# EAGLE design CR78-SD (EAGLE 7.6.0)
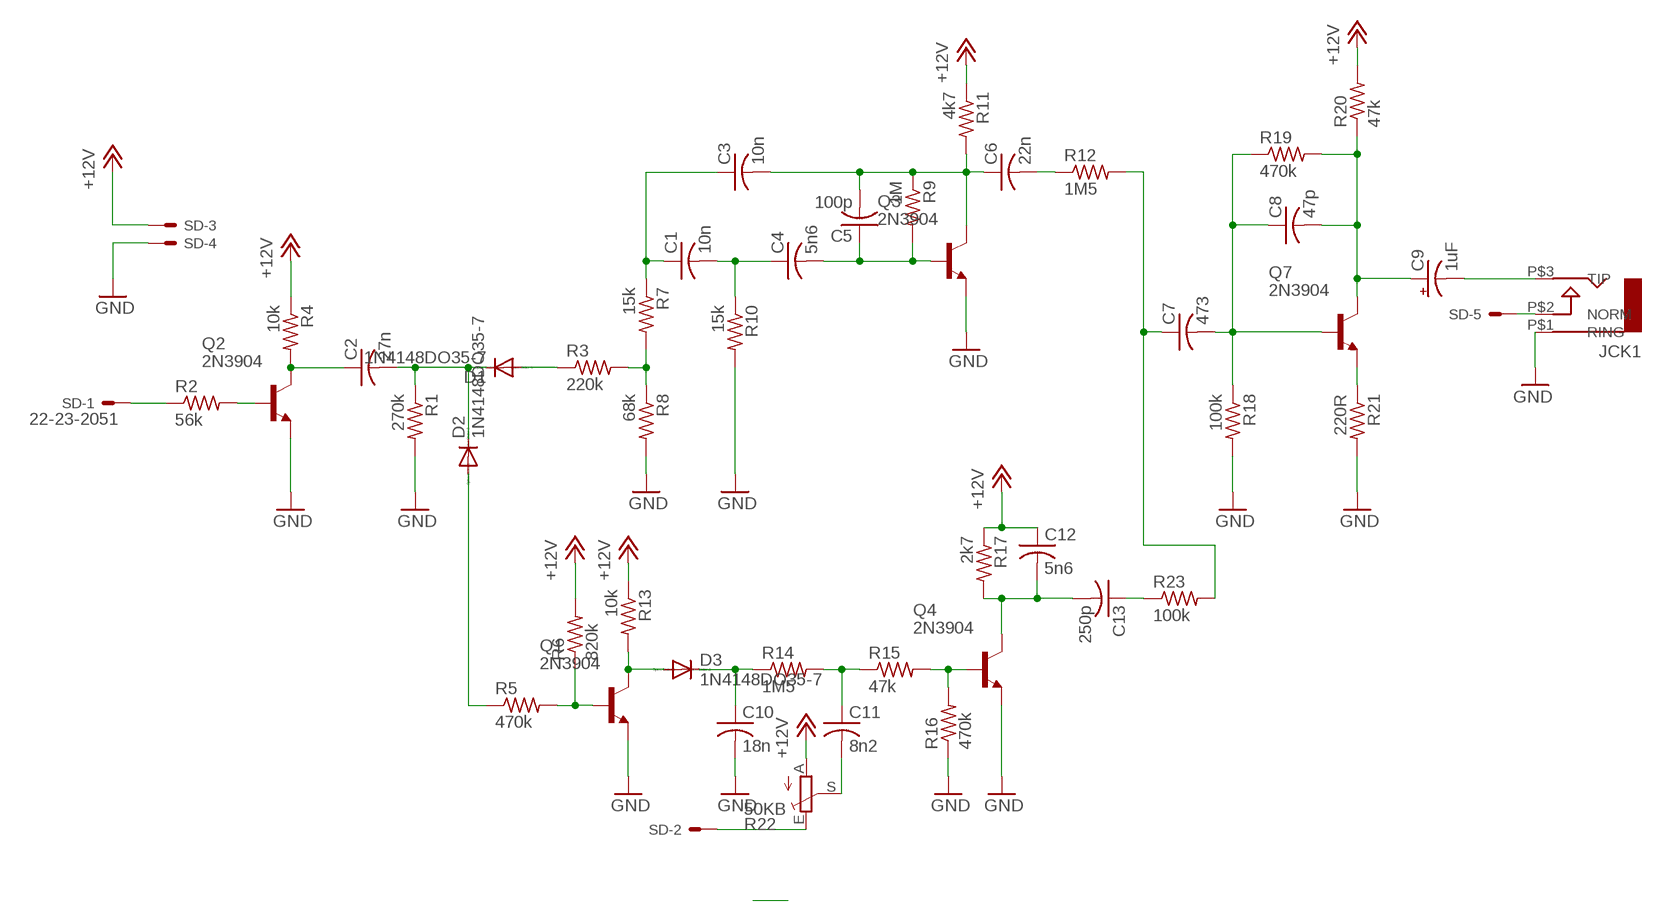
[diagram p0: schematic, sheet 1]

## Parts
C1  10n  C-US050-025X075  [C050-025X075]
C2  27n  C-US050-025X075  [C050-025X075]
C3  10n  C-US050-025X075  [C050-025X075]
C4  5n6  C-US050-025X075  [C050-025X075]
C5  100p  C-US050-025X075  [C050-025X075]
C6  22n  C-US050-025X075  [C050-025X075]
C7  473  C-US050-025X075  [C050-025X075]
C8  47p  C-US050-025X075  [C050-025X075]
C9  1uF  CPOL-USB45181B  [B45181B]
C10  18n  C-US050-025X075  [C050-025X075]
C11  8n2  C-US050-025X075  [C050-025X075]
C12  5n6  C-US050-025X075  [C050-025X075]
C13  250p  C-US050-025X075  [C050-025X075]
D1  1N4148DO35-7  [DO35-7]
D2  1N4148DO35-7  [DO35-7]
D3  1N4148DO35-7  [DO35-7]
JCK1  AUDIO-JACK  [ERTHENVAR-JACK-90DEG]
Q1  2N3904  [TO92]
Q2  2N3904  [TO92]
Q3  2N3904  [TO92]
Q4  2N3904  [TO92]
Q7  2N3904  [TO92]
R1  270k  R-US_0207/7  [0207/7]
R2  56k  R-US_0207/7  [0207/7]
R3  220k  R-US_0207/7  [0207/7]
R4  10k  R-US_0207/7  [0207/7]
R5  470k  R-US_0207/7  [0207/7]
R6  820k  R-US_0207/7  [0207/7]
R7  15k  R-US_0207/7  [0207/7]
R8  68k  R-US_0207/7  [0207/7]
R9  1M  R-US_0207/7  [0207/7]
R10  15k  R-US_0207/7  [0207/7]
R11  4k7  R-US_0207/7  [0207/7]
R12  1M5  R-US_0207/7  [0207/7]
R13  10k  R-US_0207/7  [0207/7]
R14  1M5  R-US_0207/7  [0207/7]
R15  47k  R-US_0207/7  [0207/7]
R16  470k  R-US_0207/7  [0207/7]
R17  2k7  R-US_0207/7  [0207/7]
R18  100k  R-US_0207/7  [0207/7]
R19  470k  R-US_0207/7  [0207/7]
R20  47k  R-US_0207/7  [0207/7]
R21  220R  R-US_0207/7  [0207/7]
R22  50KB  TRIM_EU-B64Y  [B64Y]
R23  100k  R-US_0207/7  [0207/7]
SD  22-23-2051  [22-23-2051]

## Nets
+12V: C12.1 R4.1 R6.2 R11.1 R13.1 R17.1 R20.2 R22.A SD.3
GND: C10.2 JCK1.P$1(RING) Q1.3(E) Q2.3(E) Q3.3(E) Q4.3(E) R1.2 R8.2 R10.2 R16.1 R18.2 R21.2 SD.4
N$1: D1.A R3.1
N$2: C2.2 D1.C D2.C R1.1
N$3: D2.A R5.1
N$4: R3.2 R7.2 R8.1
N$5: C3.2 C5.2 C6.1 Q3.1(C) R9.1 R11.2
N$6: C1.2 C4.1 R10.1
N$7: JCK1.P$2(NORM) SD.5
N$8: C1.1 C3.1 R7.1
N$9: C4.2 C5.1 Q3.2(B) R9.2
N$10: D3.A Q1.1(C) R13.2
N$11: R2.1 SD.1
N$12: C6.2 R12.1
N$13: C7.1 R12.2 R23.2
N$14: Q1.2(B) R5.2 R6.1
N$15: Q7.3(E) R21.1
N$16: C8.2 C9.+ Q7.1(C) R19.2 R20.1
N$17: C10.1 D3.C R14.1
N$18: C7.2 C8.1 Q7.2(B) R18.1 R19.1
N$19: C9.- JCK1.P$3(TIP)
N$20: C11.1 R14.2 R15.1
N$21: Q4.2(B) R15.2 R16.2
N$23: C11.2 R22.S
N$24: R22.E SD.2
N$26: C12.2 C13.2 Q4.1(C) R17.2
N$27: C13.1 R23.1
N$46: C2.1 Q2.1(C) R4.2
N$47: Q2.2(B) R2.2

## Library data of the parts
C1-C8 C10-C13 = rcl:C-US: CAPACITOR, American symbol
C9 = rcl:CPOL-US: POLARIZED CAPACITOR, American symbol
D1-D3 = diode:1N4148: DIODE high speed (Philips)
JCK1 = erthenvar:AUDIO-JACK: Switching Mono 3.5mm Audio Jack from Erthenvar.
Q1-Q4 Q7 = 808_lt:2N3904: NPN Transistor
R1-R21 R23 = rcl:R-US_: RESISTOR, American symbol
R22 = TR808clone:TRIM_EU-: POTENTIOMETER
SD = con-molex:22-23-2051: .100" (2.54mm) Center Header - 5 Pin; MF: MOLEX; MPN: 22-23-2051; OC_FARNELL: 1462952; OC_NEWARK: 38C9178

## Net classes
0 default: width 0.635 mm, drill 0.254 mm, clearance 0.254 mm
1 GND: width 1.016 mm, drill 1.016 mm, clearance 0.508 mm

## Board
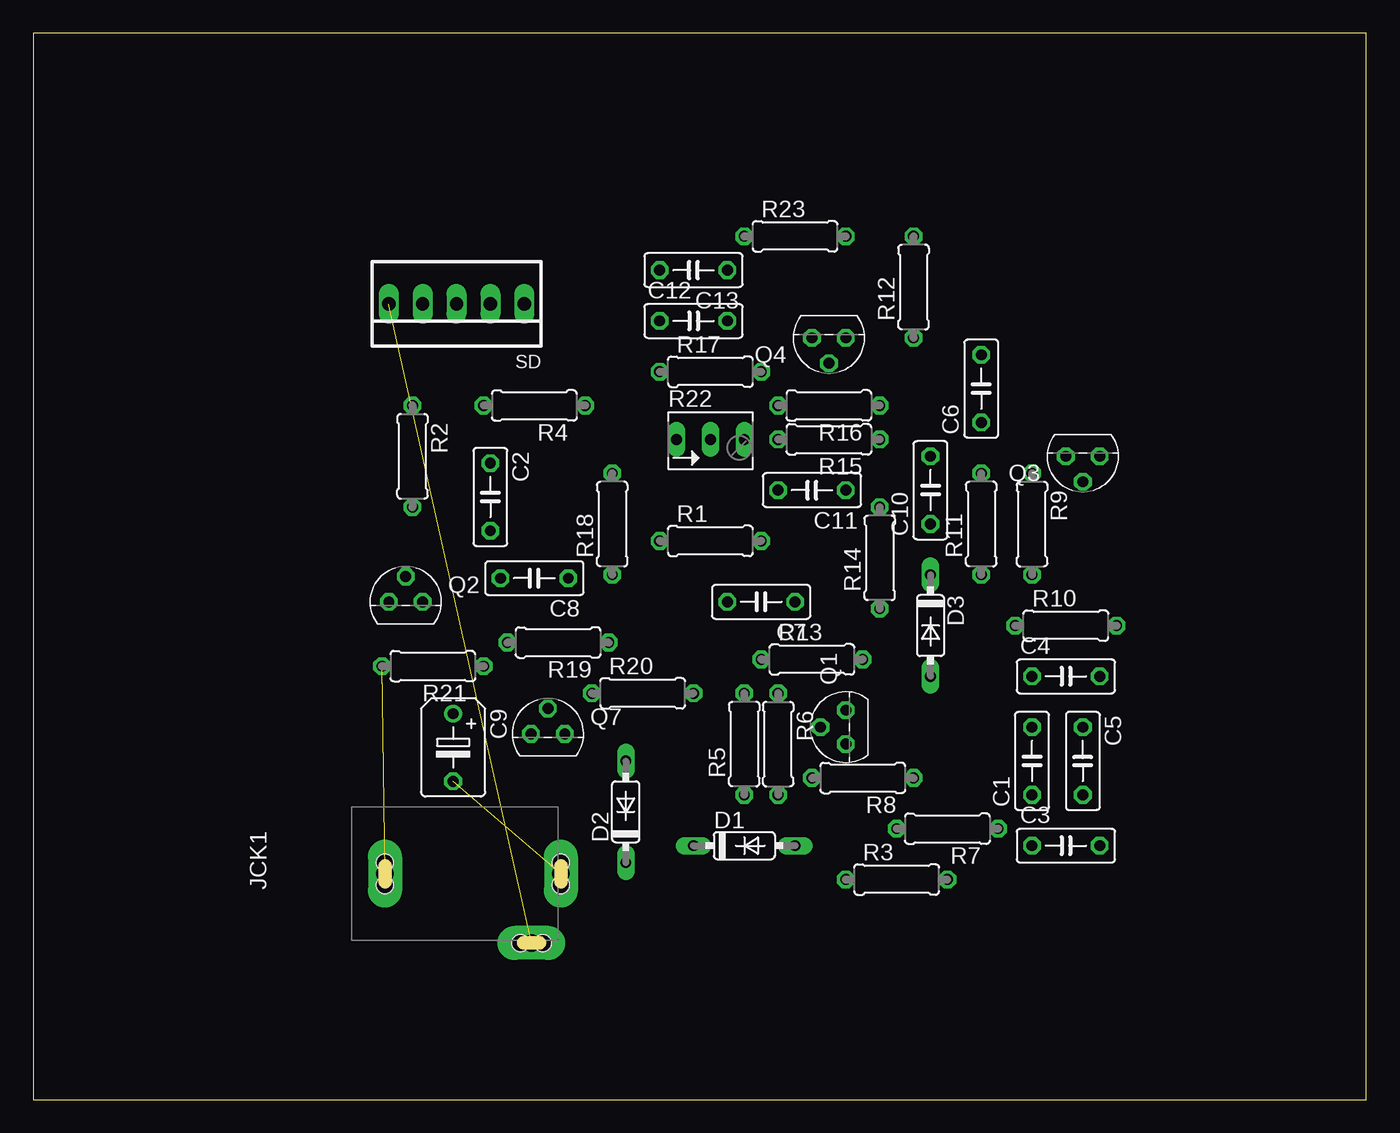
[diagram p1: board, top side]
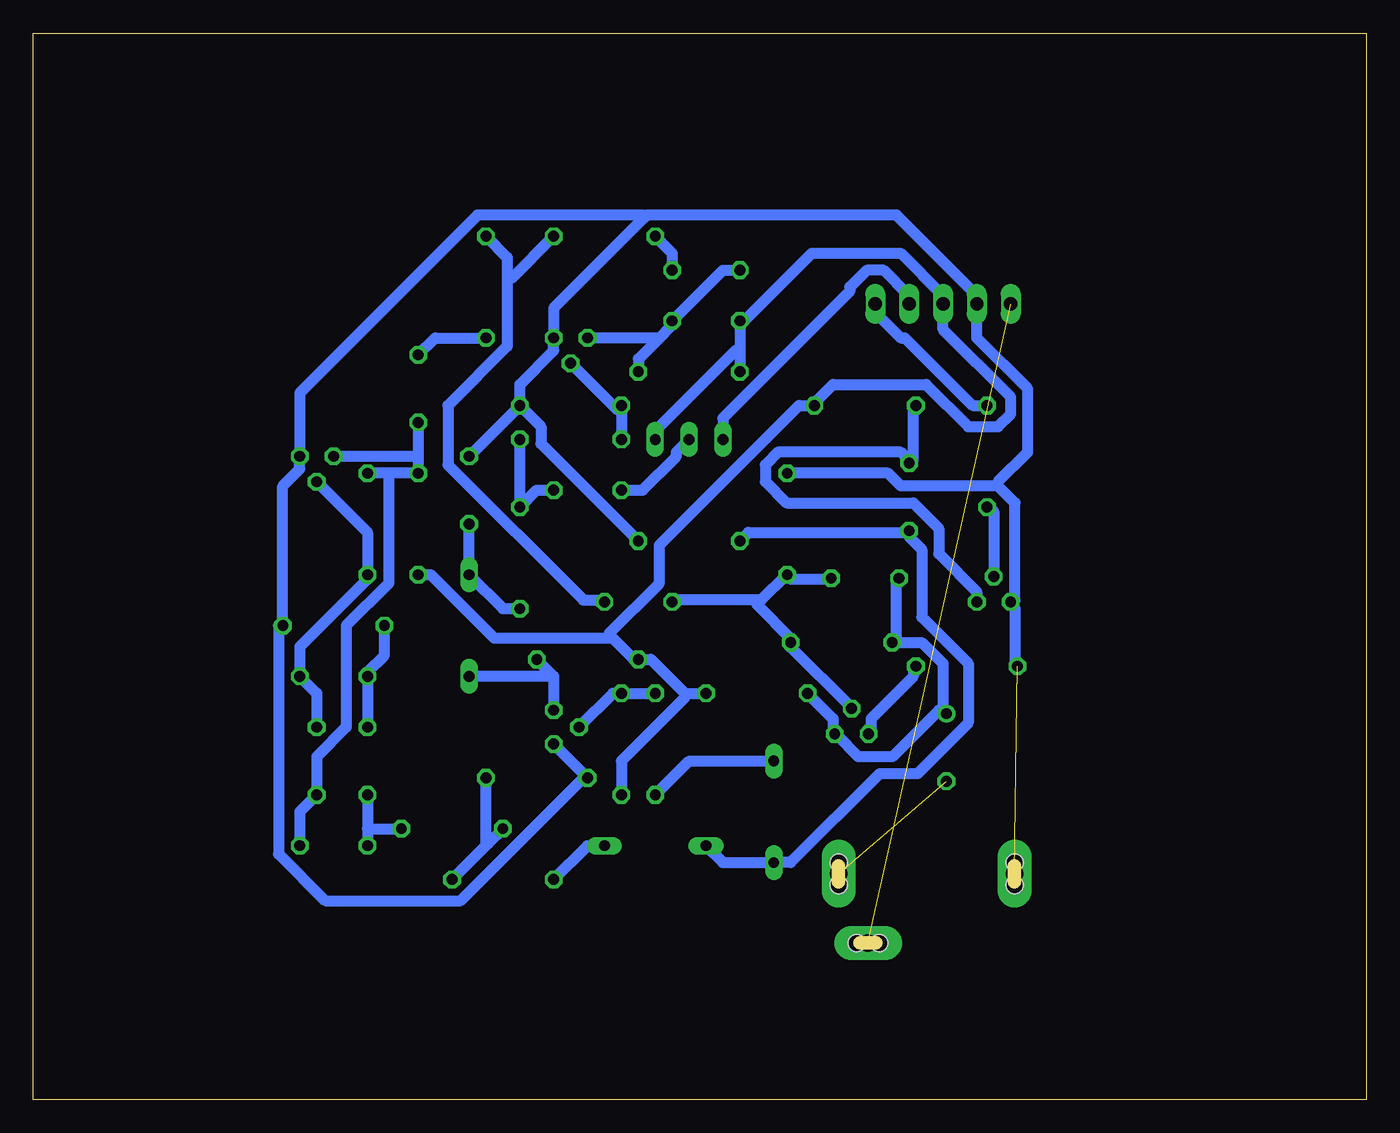
[diagram p2: board, bottom side, seen from below]

Size 100 x 80 mm. Coordinates in mm from the lower left corner, seen from the top.
Outline: 0,0 100,0 100,80 0,80 0,0
Copper layers (1*16): Top 0.035mm / dielectric 1.5mm / Bottom 0.035mm
Design rules "default *": minimum track width 32mil, minimum drill 31mil, track to track 18mil, track to pad 18mil, pad to pad 18mil, via to via 18mil, smd to smd 8mil, copper to edge 0mil, drill to drill 18mil, minimum pad ring 10mil, minimum via ring 8mil, stop-mask expansion 4mil, vias tented up to drill 0mil, thermal gap 10mil

### Footprints (pad centres in the part's own frame; a part is rotated, then mirrored left to right if it is on the bottom)
C050-025X075 = drill 0.813 octagon: 1 -2.54,0; 2 2.54,0
B45181B = drill 0.813: + -2.54,0 | drill 0.813 octagon: - 2.54,0
DO35-7 = drill 0.813 long: A 3.81,0; C -3.81,0
ERTHENVAR-JACK-90DEG = drill 1.3 pad 2.54 long: P$1 5,-2.5; P$2 -0.2,-13.5; P$3 5,-15.7 | hole 1.3: 5.842,-2.489; 4.14,-2.489; -0.203,-12.649; -0.203,-14.351; 5.842,-15.697; 4.166,-15.697
TO92 = drill 0.813 octagon: 1 1.27,0; 2 0,1.905; 3 -1.27,0
0207/7 = drill 0.813 octagon: 1 -3.81,0; 2 3.81,0
B64Y = drill 0.813 long: A 2.54,0; E -2.54,0; S 0,0
22-23-2051 = drill 1 long: 1 -5.08,0; 2 -2.54,0; 3 0,0; 4 2.54,0; 5 5.08,0

### Placement (x,y rotation side)
C1  74.93,25.4 90 top
C2  34.29,45.21 270 top
C3  77.47,19.05 0 top
C4  77.47,31.75 0 top
C5  78.74,25.4 270 top
C6  71.12,53.34 90 top
C7  54.61,37.34 180 top
C8  37.59,39.12 180 top
C9  31.5,26.42 270 top
C10  67.31,45.72 90 top
C11  58.42,45.72 180 top
C12  49.53,58.42 0 top
C13  49.53,62.23 180 top
D1  53.34,19.05 0 top
D2  44.45,21.59 90 top
D3  67.31,35.56 270 top
JCK1  23.88,11.94 90 top
Q1  60.96,27.94 90 top
Q2  27.94,37.34 0 top
Q3  78.74,48.26 180 top
Q4  59.69,57.15 180 top
Q7  38.61,27.43 0 top
R1  50.8,41.91 0 top
R2  28.45,48.26 270 top
R3  64.77,16.51 0 top
R4  37.59,52.07 180 top
R5  53.34,26.67 90 top
R6  55.88,26.67 270 top
R7  68.58,20.32 180 top
R8  62.23,24.13 180 top
R9  74.93,43.18 270 top
R10  77.47,35.56 0 top
R11  71.12,43.18 90 top
R12  66.04,60.96 90 top
R13  58.42,33.02 0 top
R14  63.5,40.64 90 top
R15  59.69,49.53 180 top
R16  59.69,52.07 180 top
R17  50.8,54.61 0 top
R18  43.43,43.18 90 top
R19  39.37,34.29 180 top
R20  45.72,30.48 0 top
R21  29.97,32.51 180 top
R22  50.8,49.53 0 top
R23  57.15,64.77 0 top
SD  31.75,59.69 180 top

### Tracks (layer width: path | path; a pad name or v marks a point on that pad's centre or on a via)
+12V
  Bottom 0.813: 46.99,56.2 C12.1 46.67,58.42 41.59,63.5 34.92,63.5 31.75,60.33 SD.3 31.75,57.78 26.67,52.7 26.67,51.44 27.62,50.48 29.84,50.48 33.02,53.66 40.01,53.66 41.27,52.39 R4.1 42.55,52.07 53.02,41.59 53.02,38.73 56.83,34.92 56.83,34.61 | 46.99,56.2 R17.1 | R22.A 53.34,50.16 47.31,56.2 46.99,56.2 | 51.12,30.48 R20.2 | 51.12,30.48 53.66,33.02 R13.1 54.93,33.02 56.52,34.61 56.83,34.61 | R6.2 55.88,25.4 51.12,30.16 51.12,30.48 | R11.1 70.17,39.37 65.41,34.61 56.83,34.61
GND  (1 unrouted)
  Bottom 0.813: Q1.3 R8.2 58.74,24.13 67.94,14.92 78.11,14.92 81.6,18.41 81.6,35.56 R10.2 81.28,46.04 80.01,47.31 Q3.3 80.01,53.02 66.67,66.36 54.29,66.36 54.13,66.2 | R1.2 61.91,49.21 61.91,50.48 R16.1 | R16.1 C10.2 | R16.1 63.5,53.66 60.96,56.2 Q4.3 60.96,59.37 54.13,66.2 | R21.2 26.35,32.7 26.35,36.83 26.67,37.15 Q2.3 26.35,37.47 26.35,44.77 27.62,46.04 | R18.2 35.88,46.99 34.92,46.04 27.62,46.04 | 27.62,46.04 27.62,46.35 25.4,48.58 25.4,53.34 29.21,57.15 SD.4 29.21,60.33 35.24,66.36 53.98,66.36 54.13,66.2
N$1
  Bottom 0.813: D1.A 58.42,19.05 R3.1
N$2
  Bottom 0.813: D1.C 48.26,17.78 D2.C 43.18,17.78 36.51,24.45 33.66,24.45 29.84,28.26 29.84,32.7 33.34,36.2 33.34,41.27 34.29,42.23 C2.2 34.29,42.55 46.35,42.55 R1.1
N$3
  Bottom 0.813: D2.A 50.8,25.4 R5.1
N$4
  Bottom 0.813: R7.2 65.88,19.21 | 65.88,19.21 R3.2 | R8.1 66.04,19.37 65.88,19.21
N$5
  Bottom 0.813: C3.2 80.01,21.59 C5.2 78.74,25.72 76.52,27.94 76.52,35.56 73.34,38.73 73.34,46.99 | C6.1 71.12,48.26 | 71.12,48.26 R11.2 73.34,46.99 | 73.34,46.99 R9.1 | 71.12,48.26 Q3.1
N$6
  Bottom 0.813: C1.2 C4.1 74.93,32.07 73.66,33.34 R10.1
N$7  (1 unrouted)
N$8
  Bottom 0.813: C1.1 74.93,20.32 | 74.93,20.32 C3.1 | 74.93,20.32 R7.1
N$9
  Bottom 0.813: C5.1 78.74,30.48 C4.2 80.01,33.97 74.93,39.05 R9.2 74.93,42.55 Q3.2
N$10
  Bottom 0.813: 60.96,31.75 Q1.1 | R13.2 60.96,31.75 | 60.96,31.75 D3.A
N$11
  Bottom 0.813: R2.1 29.53,52.07 34.61,57.15 34.92,57.15 36.83,59.05 SD.1
N$12
  Bottom 0.813: R12.1 69.85,57.15 C6.2
N$13
  Bottom 0.813: 64.45,61.59 64.45,63.18 R12.2 | 64.45,61.59 64.45,56.52 68.9,52.07 68.9,47.62 58.74,37.47 57.15,37.47 C7.1 | R23.2 64.14,61.59 64.45,61.59
N$14
  Bottom 0.813: R5.2 R6.1 56.52,30.48 Q1.2
N$15
  Bottom 0.813: Q7.3 37.15,27.62 37.15,28.57 33.97,31.75 33.97,32.38 R21.1
N$16
  Bottom 0.813: R20.1 40.01,28.57 40.01,27.62 Q7.1 39.69,27.3 38.1,25.72 35.56,25.72 32.07,29.21 C9.+ 31.75,29.21 31.75,32.7 33.34,34.29 R19.2 35.24,34.61 35.24,39.05 C8.2
N$17
  Bottom 0.813: R14.1 64.77,36.83 D3.C C10.1
N$18
  Bottom 0.813: Q7.2 38.73,29.53 43.18,33.97 R19.1 43.18,34.61 45.72,37.15 45.72,37.47 | 45.72,37.47 45.4,37.47 43.5,39.37 R18.1 43.18,39.05 40.32,39.05 C8.1 | 45.72,37.47 52.07,37.47 C7.2
N$19  (1 unrouted)
N$20
  Bottom 0.813: C11.1 62.23,45.72 R14.2 R15.1
N$21
  Bottom 0.813: R15.2 R16.2 56.2,51.75 Q4.2
N$23
  Bottom 0.813: R22.S 51.75,48.58 51.75,48.26 54.29,45.72 C11.2
N$24
  Bottom 0.813: R22.E 48.26,51.12 38.73,60.64 38.73,60.96 37.47,62.23 36.2,62.23 34.29,60.33 SD.2
N$26
  Bottom 0.813: C13.2 48.26,62.23 C12.2 52.07,58.1 53.18,56.99 | R17.2 54.61,55.56 53.18,56.99 | Q4.1 53.34,57.15 53.18,56.99
N$27
  Bottom 0.813: C13.1 52.07,63.5 R23.1
N$46
  Bottom 0.813: Q2.1 29.21,38.1 32.07,40.96 32.07,42.86 33.97,44.77 43.5,44.77 45.09,46.35 45.09,47.62 44.13,48.58 34.92,48.58 34.29,47.94 C2.1 33.97,47.94 33.97,52.07 R4.2
N$47
  Bottom 0.813: Q2.2 27.94,44.13 28.26,44.45 R2.2